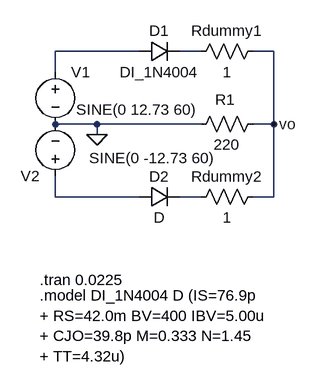
[diagram p0: schematic OndaCompleta.asc]
OndaCompleta.asc, the LTspice schematic file:
Version 4.1
SHEET 1 1284 680
WIRE 160 112 32 112
WIRE 256 112 224 112
WIRE 368 112 336 112
WIRE 32 144 32 112
WIRE 96 224 32 224
WIRE 256 224 96 224
WIRE 368 224 368 112
WIRE 368 224 336 224
WIRE 96 240 96 224
WIRE 32 336 32 304
WIRE 160 336 32 336
WIRE 256 336 224 336
WIRE 368 336 368 224
WIRE 368 336 336 336
FLAG 96 240 0
FLAG 368 224 vo
SYMBOL voltage 32 128 R0
WINDOW 123 0 0 Left 0
WINDOW 39 0 0 Left 0
WINDOW 3 32 74 Left 2
SYMATTR Value SINE(0 12.73 60)
SYMATTR InstName V1
SYMBOL res 352 96 R90
WINDOW 0 0 56 VBottom 2
WINDOW 3 32 56 VTop 2
SYMATTR InstName Rdummy1
SYMATTR Value 1
SYMBOL diode 160 128 R270
WINDOW 0 32 32 VTop 2
WINDOW 3 0 32 VBottom 2
SYMATTR InstName D1
SYMATTR Value DI_1N4004
SYMBOL voltage 32 320 R180
WINDOW 123 0 0 Left 0
WINDOW 39 0 0 Left 0
WINDOW 3 -247 44 Left 2
SYMATTR Value SINE(0 -12.73 60)
SYMATTR InstName V2
SYMBOL res 352 208 R90
WINDOW 0 -6 59 VBottom 2
WINDOW 3 32 56 VTop 2
SYMATTR InstName R1
SYMATTR Value 220
SYMBOL res 352 320 R90
WINDOW 0 0 56 VBottom 2
WINDOW 3 32 56 VTop 2
SYMATTR InstName Rdummy2
SYMATTR Value 1
SYMBOL diode 160 352 R270
WINDOW 0 32 32 VTop 2
WINDOW 3 0 32 VBottom 2
SYMATTR InstName D2
TEXT 8 464 Left 2 !.tran 0.0225
TEXT 8 488 Left 2 !.model DI_1N4004 D (IS=76.9p \n+ RS=42.0m BV=400 IBV=5.00u \n+ CJO=39.8p M=0.333 N=1.45 \n+ TT=4.32u)

The netlist it stands for:
* OndaCompleta.asc
V1 N001 0 SINE(0 12.73 60)
Rdummy1 vo N002 1
D1 N001 N002 DI_1N4004
V2 N003 0 SINE(0 -12.73 60)
R1 vo 0 220
Rdummy2 vo N004 1
D2 N003 N004 D
.model D D
.lib standard.dio
.tran 0.0225
.model DI_1N4004 D (IS=76.9p
+ RS=42.0m BV=400 IBV=5.00u
+ CJO=39.8p M=0.333 N=1.45
+ TT=4.32u)
.backanno
.end